# Altium schematic sheet sm32_sx1278.SchDoc
size A4
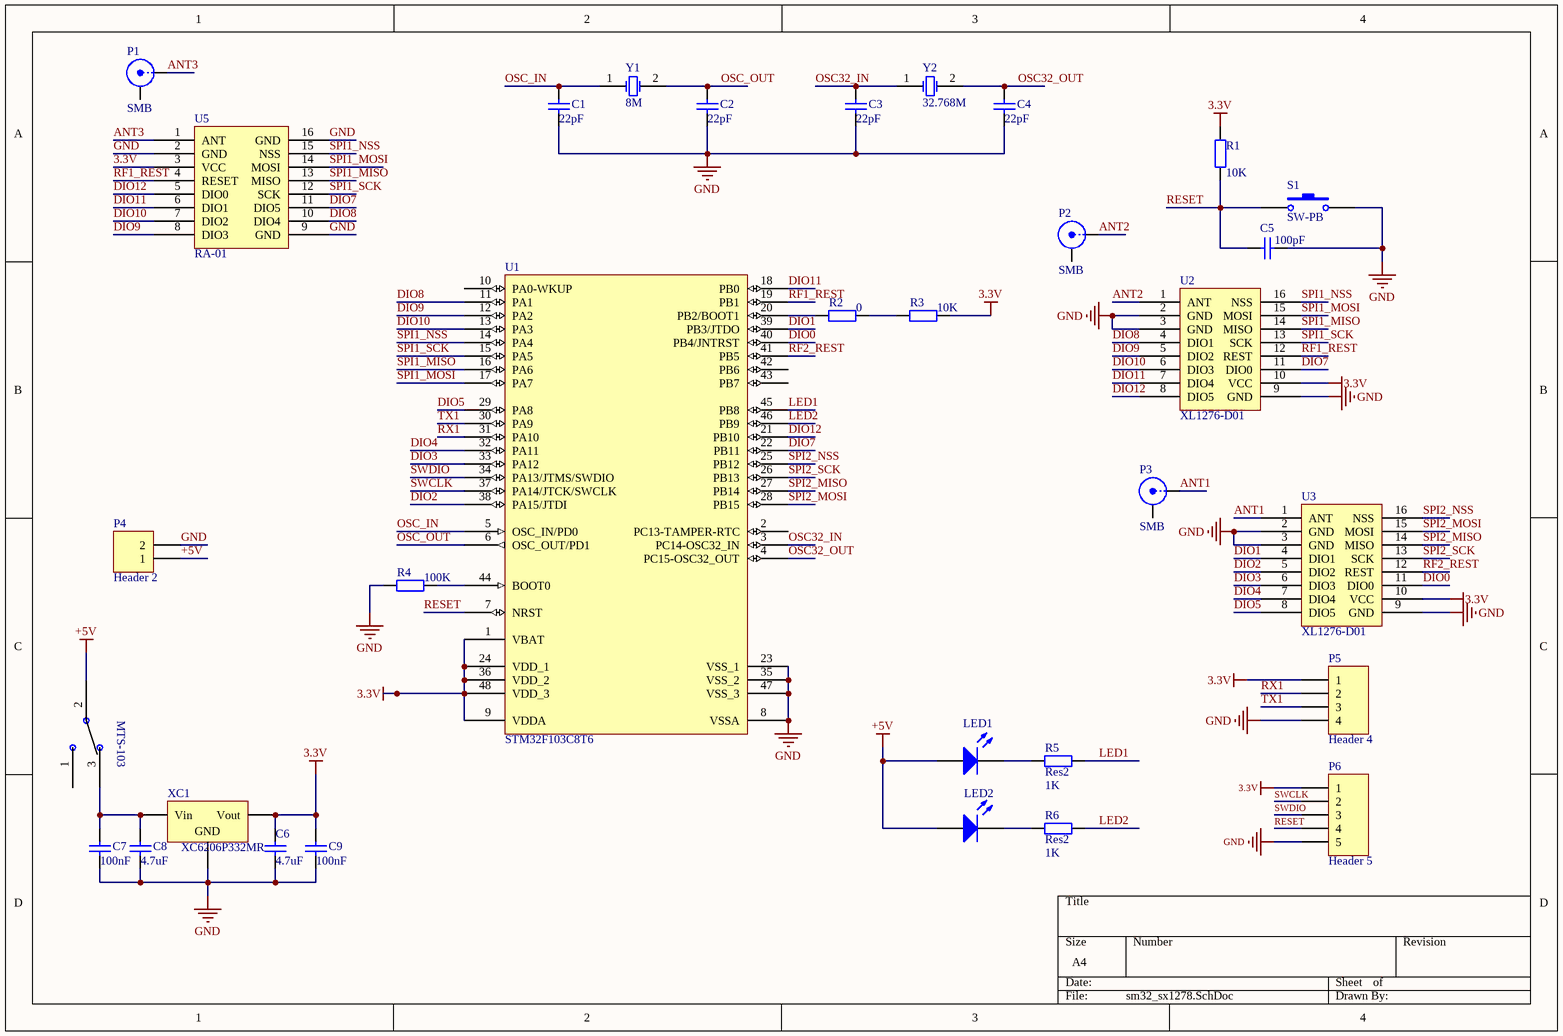
[diagram p0: sm32_sx1278.SchDoc]

## Parts
C1  value 22pF  [1608[0603]]  (hidden comment: Cap Semi)
C2  value 22pF  [1608[0603]]  (hidden comment: Cap Semi)
C3  value 22pF  [1608[0603]]  (hidden comment: Cap Semi)
C4  value 22pF  [1608[0603]]  (hidden comment: Cap Semi)
C5  value 100pF  [1608[0603]]  (hidden comment: Cap Semi)
C6  value 4.7uF  [1608[0603]]  (hidden comment: Cap Semi)
C7  value 100nF  [1608[0603]]  (hidden comment: Cap Semi)
C8  value 4.7uF  [1608[0603]]  (hidden comment: Cap Semi)
C9  value 100nF  [1608[0603]]  (hidden comment: Cap Semi)
LED1  LED2  [3.2X1.6X1.1]  (value not drawn)
LED2  LED2  [3.2X1.6X1.1]  (value not drawn)
MTS-1  MTS-103  [MTS-103]  (value not drawn)
P1  SMB  [SMB1]
P2  SMB  [SMB1]
P3  SMB  [SMB1]
P4  Header 2  [HDR1X2]
P5  Header 4  [HDR1X4]
P6  Header 5  [HDR1X5]
R1  value 10K  [1608[0603]]  (hidden comment: Res2)
R2  value 0  [1608[0603]]  (hidden comment: Res2)
R3  value 10K  [1608[0603]]  (hidden comment: Res2)
R4  value 100K  [1608[0603]]  (hidden comment: Res2)
R5  Res2  value 1K  [1608[0603]]
R6  Res2  value 1K  [1608[0603]]
S1  SW-PB  [SPST-2]
U1  STM32F103C8T6  [LQFP48_N]
U2  XL1276-D01  [XL1278-DO1]
U3  XL1276-D01  [XL1278-DO1]
U5  RA-01  [Ra-01]
XC1  XC6206P332MR  [SOT89L]
Y1  8M  [HC-48SMD]
Y2  32.768M  [FC135]

## Nets
3.3V: C6.2 C9.2 P5.1 P6.1 R1.1 R3.2 U1.1(VBAT) U1.9(VDDA) U1.24(VDD_1) U1.36(VDD_2) U1.48(VDD_3) U2.10(VCC) U3.10(VCC) U5.3(VCC) XC1.3(Vout)
+5V: LED1.1(A) LED2.1(A) MTS-1.2 P4.1
GND: C1.1 C2.1 C3.1 C4.1 C5.2 C6.1 C7.1 C8.1 C9.1 P4.2 P5.4 P6.5 R4.1 S1.2 U1.8(VSSA) U1.23(VSS_1) U1.35(VSS_2) U1.47(VSS_3) U2.2(GND) U2.3(GND) U2.9(GND) U3.2(GND) U3.3(GND) U3.9(GND) U5.2(GND) U5.9(GND) U5.16(GND) XC1.2(GND)
ANT1: P3.1(X) U3.1(ANT)
ANT2: P2.1(X) U2.1(ANT)
ANT3: P1.1(X) U5.1(ANT)
DIO0: U1.40(PB4/JNTRST) U3.11(DIO0)
DIO1: U1.39(PB3/JTDO) U3.4(DIO1)
DIO2: U1.38(PA15/JTDI) U3.5(DIO2)
DIO3: U1.33(PA12) U3.6(DIO3)
DIO4: U1.32(PA11) U3.7(DIO4)
DIO5: U1.29(PA8) U3.8(DIO5)
DIO7: U1.22(PB11) U2.11(DIO0) U5.11(DIO5)
DIO8: U1.11(PA1) U2.4(DIO1) U5.10(DIO4)
DIO9: U1.12(PA2) U2.5(DIO2) U5.8(DIO3)
DIO10: U1.13(PA3) U2.6(DIO3) U5.7(DIO2)
DIO11: U1.18(PB0) U2.7(DIO4) U5.6(DIO1)
DIO12: U1.21(PB10) U2.8(DIO5) U5.5(DIO0)
LED1: R5.2 U1.45(PB8)
LED2: R6.2 U1.46(PB9)
OSC32_IN: C3.2 U1.3(PC14-OSC32_IN) Y2.1(OSC1)
OSC32_OUT: C4.2 U1.4(PC15-OSC32_OUT) Y2.2(OSC2)
OSC_IN: C1.2 U1.5(OSC_IN/PD0) Y1.1(OSC1)
OSC_OUT: C2.2 U1.6(OSC_OUT/PD1) Y1.2(OSC2)
RESET: C5.1 P6.4 R1.2 S1.1 U1.7(NRST)
RF1_REST: U1.19(PB1) U2.12(REST) U5.4(RESET)
RF2_REST: U1.41(PB5) U3.12(REST)
RX1: P5.2 U1.31(PA10)
SPI1_MISO: U1.16(PA6) U2.14(MISO) U5.13(MISO)
SPI1_MOSI: U1.17(PA7) U2.15(MOSI) U5.14(MOSI)
SPI1_NSS: U1.14(PA4) U2.16(NSS) U5.15(NSS)
SPI1_SCK: U1.15(PA5) U2.13(SCK) U5.12(SCK)
SPI2_MISO: U1.27(PB14) U3.14(MISO)
SPI2_MOSI: U1.28(PB15) U3.15(MOSI)
SPI2_NSS: U1.25(PB12) U3.16(NSS)
SPI2_SCK: U1.26(PB13) U3.13(SCK)
SWCLK: P6.2 U1.37(PA14/JTCK/SWCLK)
SWDIO: P6.3 U1.34(PA13/JTMS/SWDIO)
TX1: P5.3 U1.30(PA9)
NetC7_2: C7.2 C8.2 MTS-1.3 XC1.1(Vin)
NetLED1_2: LED1.2(K) R5.1
NetLED2_2: LED2.2(K) R6.1
NetR2_1: R2.1 U1.20(PB2/BOOT1)
NetR2_2: R2.2 R3.1
NetR4_2: R4.2 U1.44(BOOT0)

Not connected (* = marked no-connect by the designer): MTS-1 1; P1 2(Y); P2 2(Y); P3 2(Y); U1 2(PC13-TAMPER-RTC) 10(PA0-WKUP) 42(PB6) 43(PB7)

## Library data of the parts
C1-C9 = Cap Semi: Capacitor (Semiconductor SIM Model); Published: 8-Jun-2000; LatestRevisionDate: 29-May-2009; LatestRevisionNote: IPC-7351 Footprint Added.; PackageReference: C1206; Publisher: Altium Limited; PackageDescription: Chip Capacitor
LED1 LED2 = LED2: Typical RED, GREEN, YELLOW, AMBER GaAs LED; Published: 8-Jun-2000; LatestRevisionDate: 17-Jul-2002; LatestRevisionNote: Re-released for DXP Platform.; PackageVersion: Feb-2002; PackageReference: 3.2X1.6X1.1; Publisher: Altium Limited; PackageDescription: SM LED; 2 Flat Leads
P1-P3 = SMB: SMB Straight Connector; LatestRevisionDate: 17-Jul-2002; LatestRevisionNote: Re-released for DXP Platform.; Publisher: Altium Limited
P4 = Header 2: Header, 2-Pin; LatestRevisionDate: 17-Jul-2002; LatestRevisionNote: Re-released for DXP Platform.; Publisher: Altium Limited
P5 = Header 4: Header, 4-Pin; LatestRevisionDate: 17-Jul-2002; LatestRevisionNote: Re-released for DXP Platform.; Publisher: Altium Limited
P6 = Header 5: Header, 5-Pin; LatestRevisionDate: 17-Jul-2002; LatestRevisionNote: Re-released for DXP Platform.; Publisher: Altium Limited
R1-R6 = Res2: Resistor; Published: 8-Jun-2000; LatestRevisionDate: 17-Jul-2002; LatestRevisionNote: Re-released for DXP Platform.; PackageReference: AXIAL-0.4; Publisher: Altium Limited; PackageDescription: Axial Device, Thru-Hole; 2 Leads; 0.4 in Pin Spacing
S1 = SW-PB: Switch; Published: 24-Mar-1999; LatestRevisionDate: 17-Jul-2002; LatestRevisionNote: Re-released for DXP Platform.; PackageReference: SPST-2; Publisher: Altium Limited; PackageDescription: Switch; 2 Leads
U1 = STM32F103C8T6: STM32 ARM-based 32-bit MCU with 64 Kbytes Flash, 48-pin LQFP, Industrial Temperature; Published: 30-May-2008; DatasheetVersion: rev6, Mar-2008; PackageVersion: Mar-2008; PackageReference: LQFP48; Publisher: Altium Limited; PackageDescription: 48-Pin Low-Profile Quad Flat Pack, 7 x 7 mm Body, 0.5 mm Pitch (LQFP48); ComponentLink1Description: Manufacturer Link; ComponentLink1URL: www.st.com/stm32; ComponentLink2Description: Datasheet; ComponentLink2URL: http://www.st.com/stonline/products/literature/ds/13587.pdf
XC1 = Volt Reg: Voltage Regulator; Published: 24-Mar-1999; LatestRevisionDate: 29-May-2009; LatestRevisionNote: IPC-7351 Footprint Added.; PackageReference: D2PAK; Publisher: Altium Limited; PackageDescription: 3-Pin Transistor Outline Package 2.54 mm Pitch, 15.1 mm Lead Span
Y1 Y2 = XTAL: Crystal Oscillator; Published: 8-Jun-2000; LatestRevisionDate: 17-Jul-2002; LatestRevisionNote: Re-released for DXP Platform.; PackageReference: R38; Publisher: Altium Limited; PackageDescription: Crystal, Thru-Hole; 2 Leads; Body 3.1 x 8.2 mm (Dia.xH)